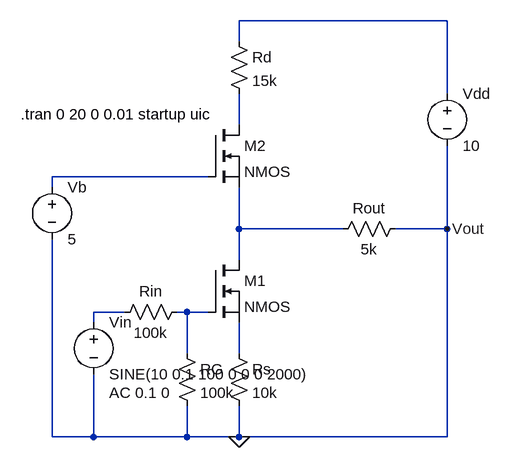
[diagram p0: schematic NMOS Cascode Amplifier (initial).asc]
NMOS Cascode Amplifier (initial).asc, the LTspice schematic file:
Version 4.1
SHEET 1 880 680
WIRE 608 -240 288 -240
WIRE 288 -208 288 -240
WIRE 608 -128 608 -240
WIRE 288 -80 288 -128
WIRE 240 0 0 0
WIRE 0 16 0 0
WIRE 288 80 288 16
WIRE 448 80 288 80
WIRE 608 80 608 -48
WIRE 608 80 528 80
WIRE 288 128 288 80
WIRE 112 208 64 208
WIRE 208 208 192 208
WIRE 240 208 208 208
WIRE 64 224 64 208
WIRE 208 272 208 208
WIRE 288 272 288 224
WIRE 0 400 0 96
WIRE 64 400 64 304
WIRE 64 400 0 400
WIRE 208 400 208 352
WIRE 208 400 64 400
WIRE 288 400 288 352
WIRE 288 400 208 400
WIRE 608 400 608 80
WIRE 608 400 288 400
FLAG 288 400 0
FLAG 608 80 Vout
SYMBOL nmos 240 128 R0
SYMATTR InstName M1
SYMBOL nmos 240 -80 R0
SYMATTR InstName M2
SYMBOL res 272 256 R0
SYMATTR InstName Rs
SYMATTR Value 10k
SYMBOL res 272 -224 R0
SYMATTR InstName Rd
SYMATTR Value 15k
SYMBOL res 208 192 R90
WINDOW 0 0 56 VBottom 2
WINDOW 3 32 56 VTop 2
SYMATTR InstName Rin
SYMATTR Value 100k
SYMBOL res 544 64 R90
WINDOW 0 0 56 VBottom 2
WINDOW 3 32 56 VTop 2
SYMATTR InstName Rout
SYMATTR Value 5k
SYMBOL voltage 64 208 R0
WINDOW 123 24 124 Left 2
WINDOW 39 0 0 Left 0
SYMATTR InstName Vin
SYMATTR Value SINE(10 0.1 100 0 0 0 2000)
SYMATTR Value2 AC 0.1 0
SYMBOL voltage 0 0 R0
WINDOW 123 0 0 Left 0
WINDOW 39 0 0 Left 0
SYMATTR InstName Vb
SYMATTR Value 5
SYMBOL voltage 608 -144 R0
WINDOW 123 0 0 Left 0
WINDOW 39 0 0 Left 0
SYMATTR InstName Vdd
SYMATTR Value 10
SYMBOL res 192 256 R0
SYMATTR InstName RG
SYMATTR Value 100k
TEXT -48 -96 Left 2 !.tran 0 20 0 0.01 startup uic

The netlist it stands for:
* NMOS Cascode Amplifier (initial).asc
M1 N004 N006 N007 N007 NMOS
M2 N002 N003 N004 N004 NMOS
Rs N007 0 10k
Rd N001 N002 15k
Rin N006 N005 100k
Rout 0 N004 5k
Vin N005 0 SINE(10 0.1 100 0 0 0 2000) AC 0.1 0
Vb N003 0 5
Vdd N001 0 10
RG N006 0 100k
.model NMOS NMOS
.model PMOS PMOS
.lib standard.mos
.tran 0 20 0 0.01 startup uic
.backanno
.end